# EAGLE schematic M161X (EAGLE 4.11)
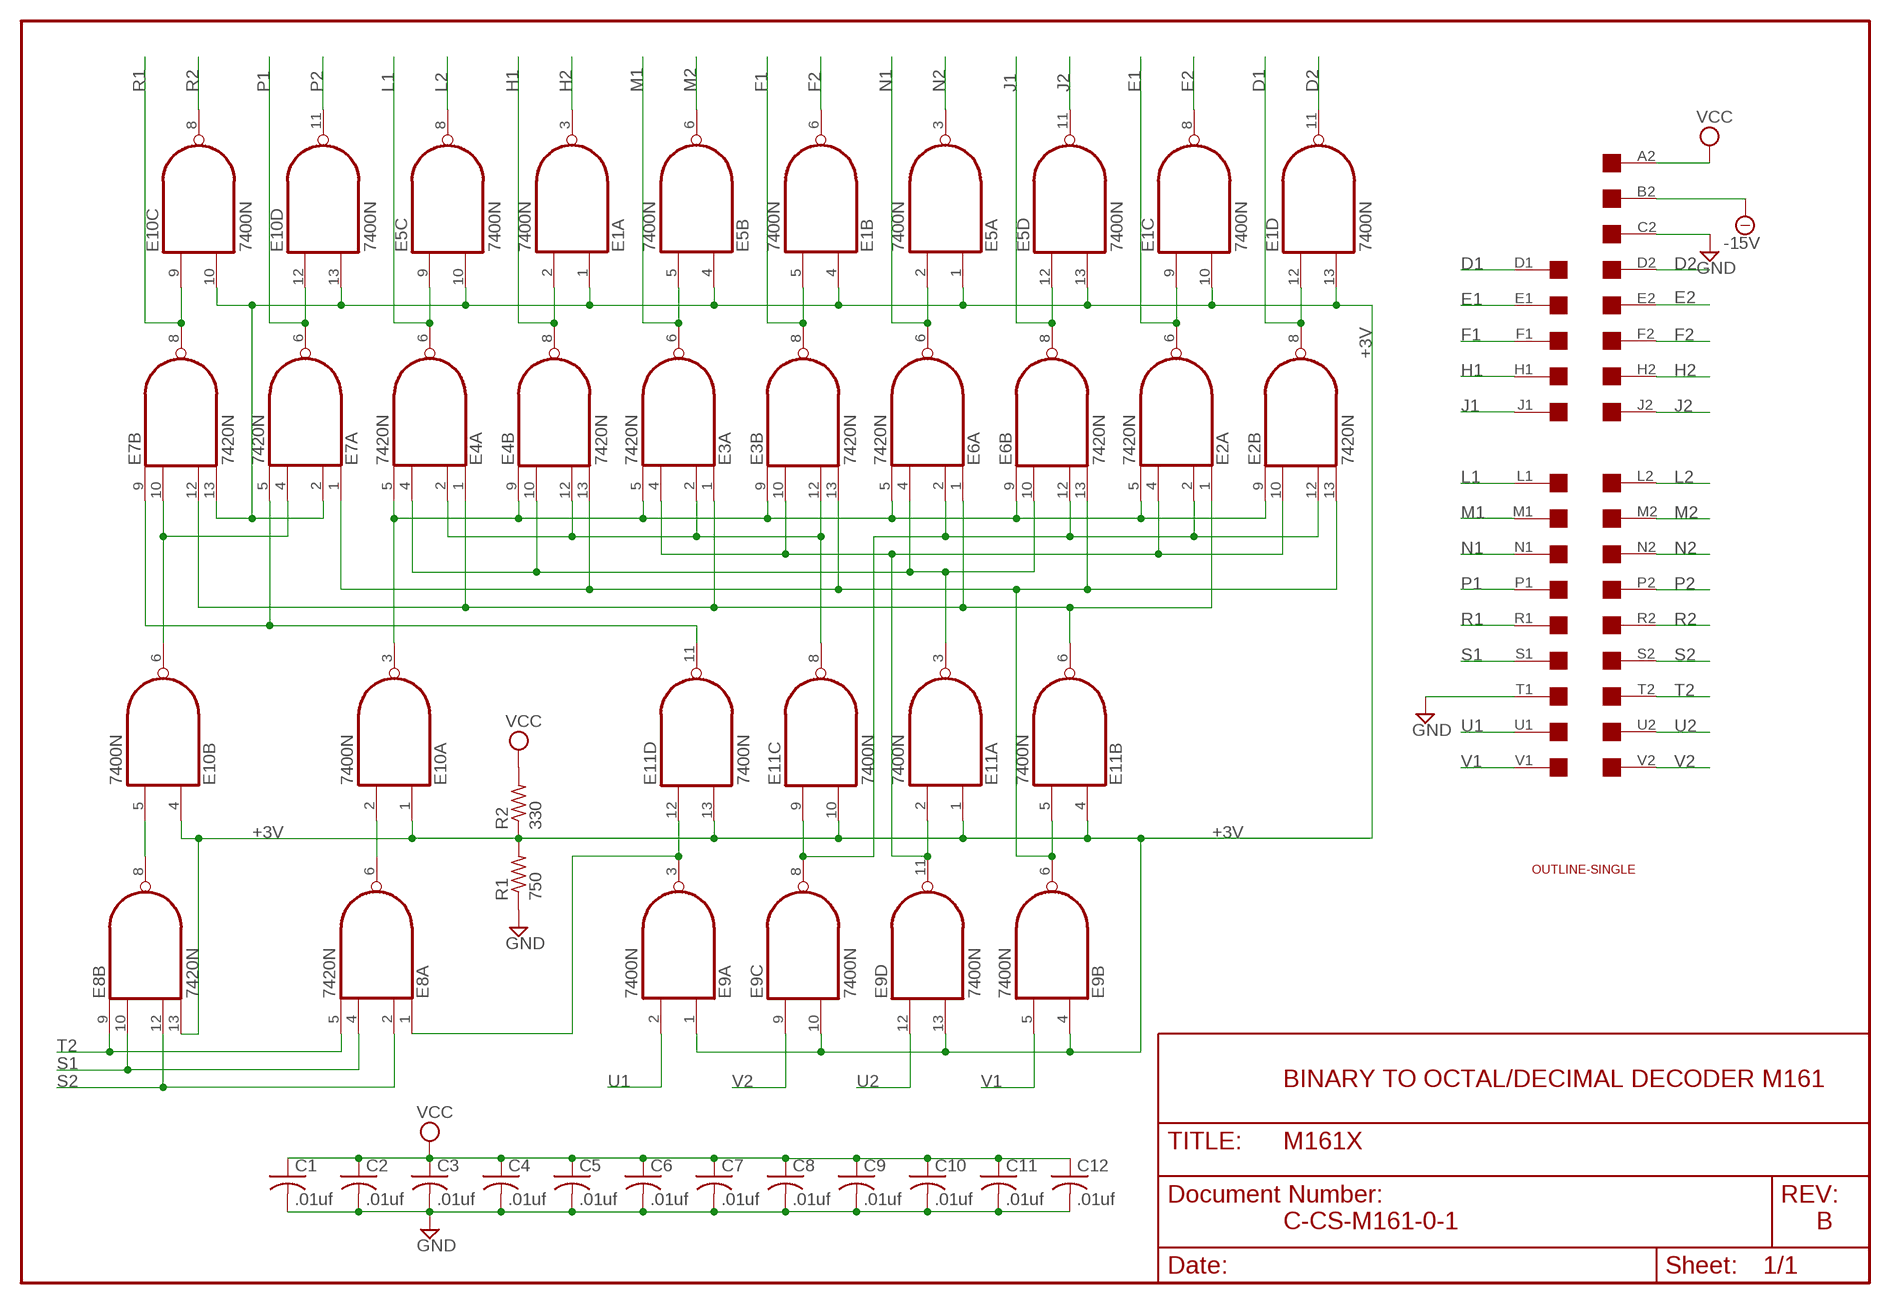
[diagram p0: schematic, sheet 1]

## Parts
C1  .01uf  C-US050-025X075  [C050-025X075]
C2  .01uf  C-US050-025X075  [C050-025X075]
C3  .01uf  C-US050-025X075  [C050-025X075]
C4  .01uf  C-US050-025X075  [C050-025X075]
C5  .01uf  C-US050-025X075  [C050-025X075]
C6  .01uf  C-US050-025X075  [C050-025X075]
C7  .01uf  C-US050-025X075  [C050-025X075]
C8  .01uf  C-US050-025X075  [C050-025X075]
C9  .01uf  C-US050-025X075  [C050-025X075]
C10  .01uf  C-US050-025X075  [C050-025X075]
C11  .01uf  C-US050-025X075  [C050-025X075]
C12  .01uf  C-US050-025X075  [C050-025X075]
E1  7400N  [DIL14]
E2  7420N  74S20N  [DIL14]
E3  7420N  74S20N  [DIL14]
E4  7420N  74S20N  [DIL14]
E5  7400N  [DIL14]
E6  7420N  74S20N  [DIL14]
E7  7420N  74S20N  [DIL14]
E8  7420N  74S20N  [DIL14]
E9  7400N  [DIL14]
E10  7400N  [DIL14]
E11  7400N  [DIL14]
R1  750  R-US_0207/10  [0207/10]
R2  330  R-US_0207/10  [0207/10]
U$1  OUTLINE-SINGLE  [SINGLE]
U$4  SINGLE  [EDGE-CON2]

## Nets
+3V [power]: E1.1(A:I0) E1.4(B:I0) E1.10(C:I1) E1.13(D:I1) E5.1(A:I0) E5.4(B:I0) E5.10(C:I1) E5.13(D:I1) E7.2(A:I1) E7.13(B:I3) E8.13(B:I3) E9.1(A:I0) E9.4(B:I0) E9.10(C:I1) E9.13(D:I1) E10.1(A:I0) E10.4(B:I0) E10.10(C:I1) E10.13(D:I1) E11.1(A:I0) E11.4(B:I0) E11.10(C:I1) E11.13(D:I1) R1.2 R2.1
-15V: U$4.B2
D1: E1.12(D:I0) E2.8(B:O) U$4.D1
D2: E1.11(D:O) U$4.D2
E1: E1.9(C:I0) E2.6(A:O) U$4.E1
E2: E1.8(C:O) U$4.E2
F1: E1.5(B:I1) E3.8(B:O) U$4.F1
F2: E1.6(B:O) U$4.F2
GND [power]: C1.2 C2.2 C3.2 C4.2 C5.2 C6.2 C7.2 C8.2 C9.2 C10.2 C11.2 C12.2 R1.1 U$4.C2 U$4.T1
H1: E1.2(A:I1) E4.8(B:O) U$4.H1
H2: E1.3(A:O) U$4.H2
J1: E5.12(D:I0) E6.8(B:O) U$4.J1
J2: E5.11(D:O) U$4.J2
L1: E4.6(A:O) E5.9(C:I0) U$4.L1
L2: E5.8(C:O) U$4.L2
M1: E3.6(A:O) E5.5(B:I1) U$4.M1
M2: E5.6(B:O) U$4.M2
N1: E5.2(A:I1) E6.6(A:O) U$4.N1
N2: E5.3(A:O) U$4.N2
N$2: E8.8(B:O) E10.5(B:I1)
N$4: E7.4(A:I2) E7.10(B:I1) E10.6(B:O)
N$5: E2.5(A:I3) E2.9(B:I0) E3.5(A:I3) E3.9(B:I0) E4.5(A:I3) E4.9(B:I0) E6.5(A:I3) E6.9(B:I0) E10.3(A:O)
N$6: E8.6(A:O) E10.2(A:I1)
N$7: E8.1(A:I0) E9.3(A:O) E11.12(D:I0)
N$8: E2.2(A:I1) E2.12(B:I2) E6.2(A:I1) E6.12(B:I2) E9.8(C:O) E11.9(C:I0)
N$9: E2.4(A:I2) E2.10(B:I1) E3.4(A:I2) E3.10(B:I1) E9.11(D:O) E11.2(A:I1)
N$10: E2.13(B:I3) E3.13(B:I3) E4.13(B:I3) E6.13(B:I3) E7.1(A:I0) E9.6(B:O) E11.5(B:I1)
N$11: E3.2(A:I1) E3.12(B:I2) E4.2(A:I1) E4.12(B:I2) E11.8(C:O)
N$12: E7.5(A:I3) E7.9(B:I0) E11.11(D:O)
N$24: E4.4(A:I2) E4.10(B:I1) E6.4(A:I2) E6.10(B:I1) E11.3(A:O)
N$25: E2.1(A:I0) E3.1(A:I0) E4.1(A:I0) E6.1(A:I0) E7.12(B:I2) E11.6(B:O)
P1: E7.6(A:O) E10.12(D:I0) U$4.P1
P2: E10.11(D:O) U$4.P2
R1: E7.8(B:O) E10.9(C:I0) U$4.R1
R2: E10.8(C:O) U$4.R2
S1: E8.4(A:I2) E8.10(B:I1) U$4.S1
S2: E8.2(A:I1) E8.12(B:I2) U$4.S2
T2: E8.5(A:I3) E8.9(B:I0) U$4.T2
U1: E9.2(A:I1) U$4.U1
U2: E9.12(D:I0) U$4.U2
V1: E9.5(B:I1) U$4.V1
V2: E9.9(C:I0) U$4.V2
VCC [power]: C1.1 C2.1 C3.1 C4.1 C5.1 C6.1 C7.1 C8.1 C9.1 C10.1 C11.1 C12.1 R2.2 U$4.A2
Unconnected: U$4.A1 U$4.B1 U$4.C1 U$4.K1 U$4.K2

## Notes on the sheet
- BINARY TO OCTAL/DECIMAL DECODER M161
- C-CS-M161-0-1 | B

## Power pins joined to a net without a drawn wire
GND: E1.7(P:GND) E2.7(P:GND) E3.7(P:GND) E4.7(P:GND) E5.7(P:GND) E6.7(P:GND) E7.7(P:GND) E8.7(P:GND) E9.7(P:GND) E10.7(P:GND) E11.7(P:GND)
VCC: E1.14(P:VCC) E2.14(P:VCC) E3.14(P:VCC) E4.14(P:VCC) E5.14(P:VCC) E6.14(P:VCC) E7.14(P:VCC) E8.14(P:VCC) E9.14(P:VCC) E10.14(P:VCC) E11.14(P:VCC)

## Library data of the parts
C1-C12 = rcl:C-US: CAPACITOR, American symbol
E1 E5 E9-E11 = 74xx-us:74*00: Quad 2-input NAND gate
E2-E4 E6-E8 = 74xx-us:74*20: Dual 4-input NAND gate
R1 R2 = rcl:R-US_: RESISTOR, American symbol
U$1 = dec-con:OUTLINE-*: Board outlines for DEC boards.
U$4 = dec-con:SINGLE: Single-Height DEC board

## Net classes
0 default: width 0.381 mm
1 power: width 0.813 mm